# Altium project IoT_EM_ADE7758_v0.PrjPCB
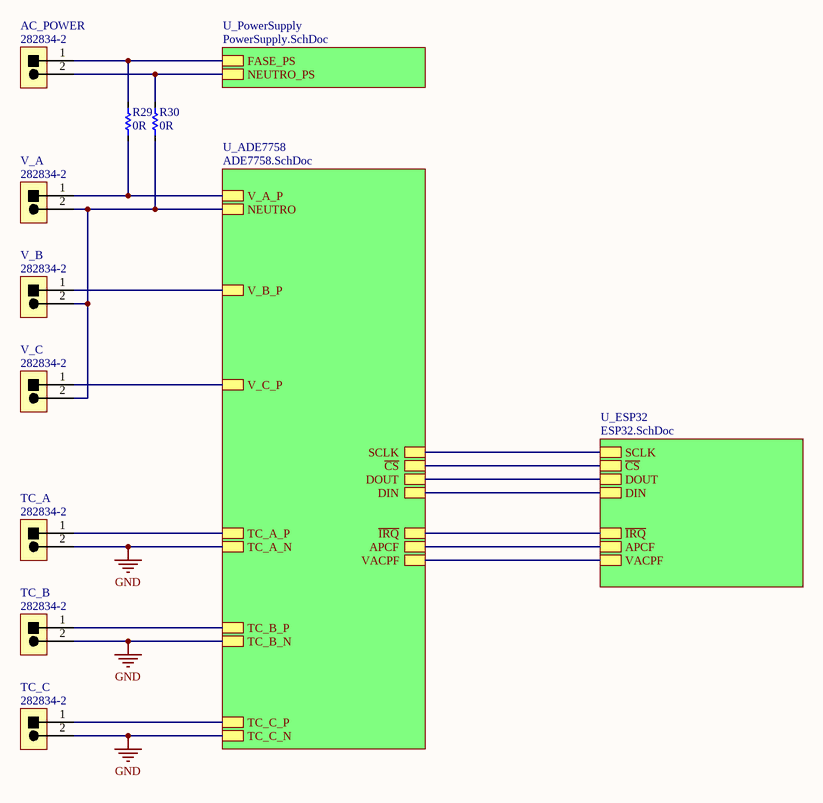
[diagram p0: Master.SchDoc]
4 sheets, 84 parts. Net scope: hierarchical (ports join the sheet entries above them; power ports are global).
Board file: IoT_EM_ADE7758_v0.PcbDoc
Sheets:
  Master.SchDoc
    U_ADE7758 = ADE7758.SchDoc
    U_PowerSupply = PowerSupply.SchDoc
    U_ESP32 = ESP32.SchDoc

## Sheet Master.SchDoc
size A4

### Parts
AC_POWER  Part Number: 282834-2  [TEC_282834-2]  (hidden comment: Conector)
R29  value 0R  [RES0603]  (hidden comment: Resistor)
R30  value 0R  [RES0603]  (hidden comment: Resistor)
TC_A  Part Number: 282834-2  [TEC_282834-2]  (hidden comment: Conector)
TC_B  Part Number: 282834-2  [TEC_282834-2]  (hidden comment: Conector)
TC_C  Part Number: 282834-2  [TEC_282834-2]  (hidden comment: Conector)
V_A  Part Number: 282834-2  [TEC_282834-2]  (hidden comment: Conector)
V_B  Part Number: 282834-2  [TEC_282834-2]  (hidden comment: Conector)
V_C  Part Number: 282834-2  [TEC_282834-2]  (hidden comment: Conector)

### Sub-sheets
U_ADE7758 = ADE7758.SchDoc: TC_A_P, TC_A_N, TC_B_P, TC_B_N, TC_C_P, TC_C_N, V_A_P, V_B_P, V_C_P, NEUTRO, SCLK, ~{CS}, DOUT, DIN, ~{IRQ}, APCF, VACPF
U_ESP32 = ESP32.SchDoc: SCLK, ~{CS}, DOUT, DIN, ~{IRQ}, APCF, VACPF
U_PowerSupply = PowerSupply.SchDoc: FASE_PS, NEUTRO_PS

### Nets
GND: TC_A.2 TC_B.2 TC_C.2 ; sheet U_ADE7758/TC_A_N, sheet U_ADE7758/TC_B_N, sheet U_ADE7758/TC_C_N
NetAC_POWER_1: AC_POWER.1 R29.1 ; sheet U_PowerSupply/FASE_PS
NetAC_POWER_2: AC_POWER.2 R30.1 ; sheet U_PowerSupply/NEUTRO_PS
NetR1_2: TC_A.1 ; sheet U_ADE7758/TC_A_P
NetR4_2: TC_B.1 ; sheet U_ADE7758/TC_B_P
NetR7_1: sheet U_ADE7758/SCLK, sheet U_ESP32/SCLK
NetR8_1: sheet U_ADE7758/~{CS}, sheet U_ESP32/~{CS}
NetR9_1: sheet U_ADE7758/DOUT, sheet U_ESP32/DOUT
NetR10_1: sheet U_ADE7758/DIN, sheet U_ESP32/DIN
NetR11_2: TC_C.1 ; sheet U_ADE7758/TC_C_P
NetR15_2: sheet U_ADE7758/~{IRQ}, sheet U_ESP32/~{IRQ}
NetR18_1: sheet U_ADE7758/APCF, sheet U_ESP32/APCF
NetR19_1: sheet U_ADE7758/VACPF, sheet U_ESP32/VACPF
NetR26_2: R30.2 V_A.2 V_B.2 V_C.2 ; sheet U_ADE7758/NEUTRO
NetR29_2: R29.2 V_A.1 ; sheet U_ADE7758/V_A_P
NetR36_2: V_B.1 ; sheet U_ADE7758/V_B_P
NetR38_2: V_C.1 ; sheet U_ADE7758/V_C_P

### Library data of the parts
AC_POWER TC_A TC_B TC_C V_A V_B V_C = Conector 2x1: TERM BLOCK 2POS SIDE ENT 2.54MM; Manufacturer: TE Connectivity AMP Connectors; Value: -; PCB Info: -

## Sheet ADE7758.SchDoc
size A4
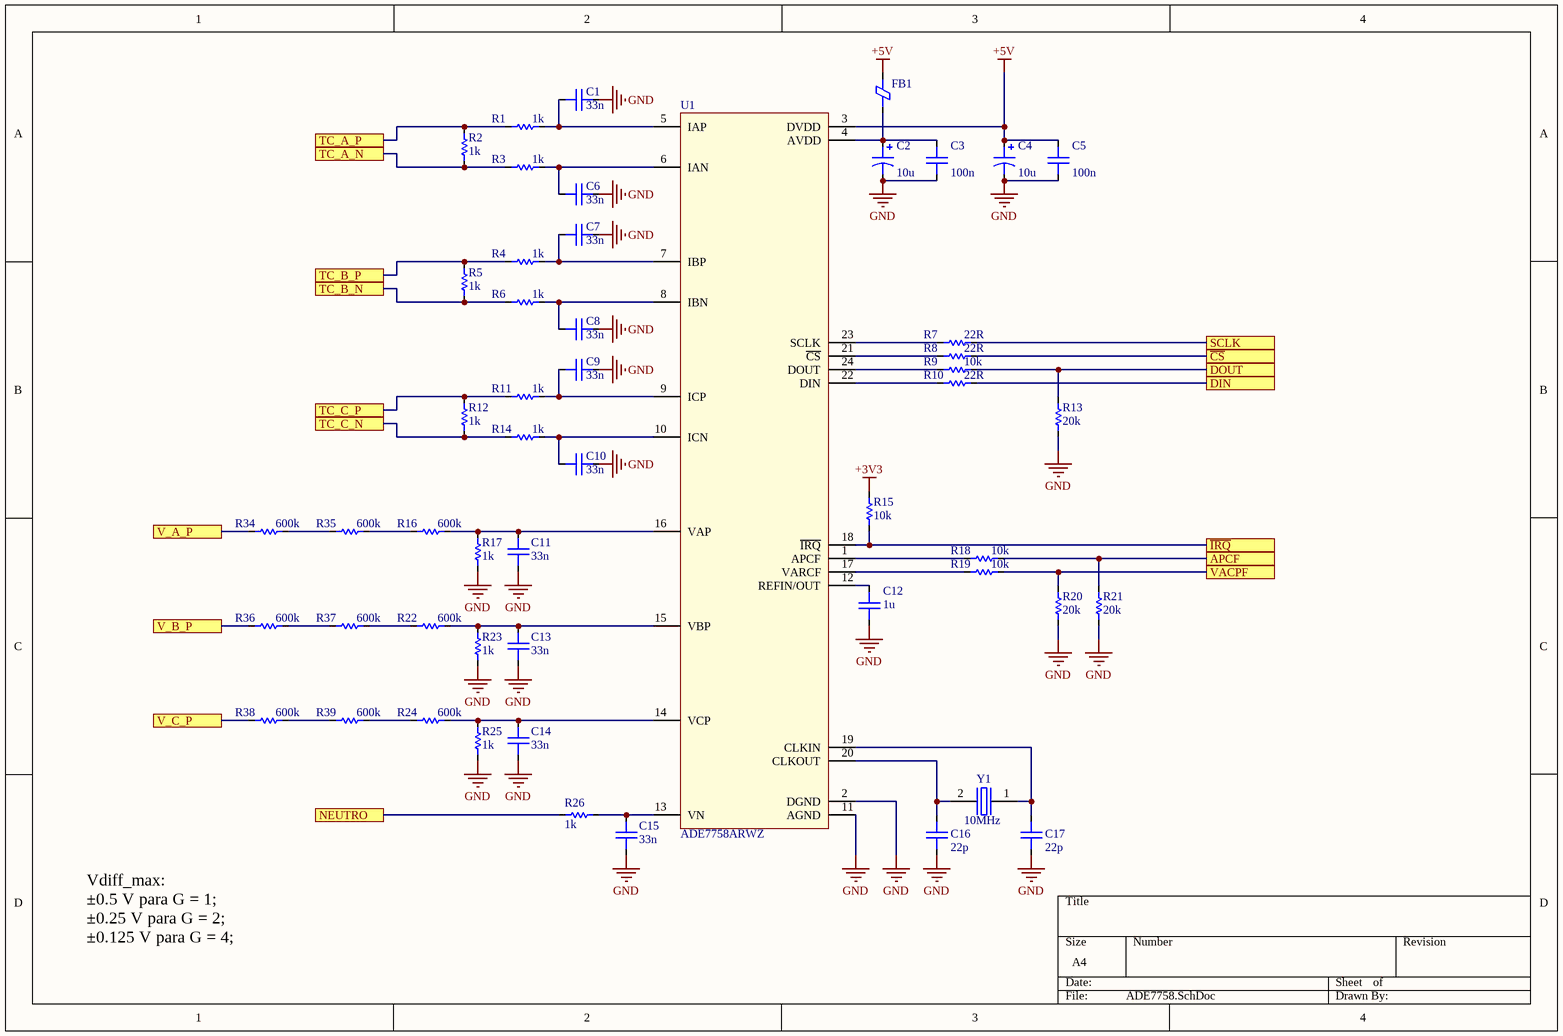
[diagram p1: ADE7758.SchDoc]

### Parts
C1  value 33n  [CAP0603]  (hidden comment: Capacitor)
C2  value 10u  [CAP1210 - TANTALUM]  (hidden comment: Capacitor)
C3  value 100n  [CAP0603]  (hidden comment: Capacitor)
C4  value 10u  [CAP1210 - TANTALUM]  (hidden comment: Capacitor)
C5  value 100n  [CAP0603]  (hidden comment: Capacitor)
C6  value 33n  [CAP0603]  (hidden comment: Capacitor)
C7  value 33n  [CAP0603]  (hidden comment: Capacitor)
C8  value 33n  [CAP0603]  (hidden comment: Capacitor)
C9  value 33n  [CAP0603]  (hidden comment: Capacitor)
C10  value 33n  [CAP0603]  (hidden comment: Capacitor)
C11  value 33n  [CAP0603]  (hidden comment: Capacitor)
C12  value 1u  [CAP0603]  (hidden comment: Capacitor)
C13  value 33n  [CAP0603]  (hidden comment: Capacitor)
C14  value 33n  [CAP0603]  (hidden comment: Capacitor)
C15  value 33n  [CAP0603]  (hidden comment: Capacitor)
C16  value 22p  [CAP0603]  (hidden comment: Capacitor)
C17  value 22p  [CAP0603]  (hidden comment: Capacitor)
FB1  Ferrite Bead  [FB0603]  (value not drawn)
R1  value 1k  [RES0603]  (hidden comment: Resistor)
R2  value 1k  [RES0603]  (hidden comment: Resistor)
R3  value 1k  [RES0603]  (hidden comment: Resistor)
R4  value 1k  [RES0603]  (hidden comment: Resistor)
R5  value 1k  [RES0603]  (hidden comment: Resistor)
R6  value 1k  [RES0603]  (hidden comment: Resistor)
R7  value 22R  [RES0603]  (hidden comment: Resistor)
R8  value 22R  [RES0603]  (hidden comment: Resistor)
R9  value 10k  [RES0603]  (hidden comment: Resistor)
R10  value 22R  [RES0603]  (hidden comment: Resistor)
R11  value 1k  [RES0603]  (hidden comment: Resistor)
R12  value 1k  [RES0603]  (hidden comment: Resistor)
R13  value 20k  [RES0603]  (hidden comment: Resistor)
R14  value 1k  [RES0603]  (hidden comment: Resistor)
R15  value 10k  [RES0603]  (hidden comment: Resistor)
R16  value 600k  [RES0603]  (hidden comment: Resistor)
R17  value 1k  [RES0603]  (hidden comment: Resistor)
R18  value 10k  [RES0603]  (hidden comment: Resistor)
R19  value 10k  [RES0603]  (hidden comment: Resistor)
R20  value 20k  [RES0603]  (hidden comment: Resistor)
R21  value 20k  [RES0603]  (hidden comment: Resistor)
R22  value 600k  [RES0603]  (hidden comment: Resistor)
R23  value 1k  [RES0603]  (hidden comment: Resistor)
R24  value 600k  [RES0603]  (hidden comment: Resistor)
R25  value 1k  [RES0603]  (hidden comment: Resistor)
R26  value 1k  [RES0603]  (hidden comment: Resistor)
R34  value 600k  [RES0603]  (hidden comment: Resistor)
R35  value 600k  [RES0603]  (hidden comment: Resistor)
R36  value 600k  [RES0603]  (hidden comment: Resistor)
R37  value 600k  [RES0603]  (hidden comment: Resistor)
R38  value 600k  [RES0603]  (hidden comment: Resistor)
R39  value 600k  [RES0603]  (hidden comment: Resistor)
U1  ADE7758ARWZ  [SOIC-24]
Y1  value 10MHz  [HDR1X2]  (hidden comment: Cristal)

### Ports
APCF, DIN, DOUT, NEUTRO, SCLK, TC_A_N, TC_A_P, TC_B_N, TC_B_P, TC_C_N, TC_C_P, V_A_P, V_B_P, V_C_P, VACPF, ~{CS}, ~{IRQ}

### Nets
+3V3: R15.1
+5V: C4.1 C5.2 FB1.1 U1.3(DVDD)
GND: C1.1 C2.2 C3.1 C4.2 C5.1 C6.1 C7.1 C8.1 C9.1 C10.1 C11.2 C12.1 C13.2 C14.2 C15.2 C16.1 C17.1 R2.2 R3.2 R5.2 R6.2 R12.2 R13.2 R14.2 R17.1 R20.2 R21.2 R23.1 R25.1 U1.2(DGND) U1.11(AGND) ; port TC_A_N, port TC_B_N, port TC_C_N
NetC1_2: C1.2 R1.1 U1.5(IAP)
NetC2_1: C2.1 C3.2 FB1.2 U1.4(AVDD)
NetC6_2: C6.2 R3.1 U1.6(IAN)
NetC7_2: C7.2 R4.1 U1.7(IBP)
NetC8_2: C8.2 R6.1 U1.8(IBN)
NetC9_2: C9.2 R11.1 U1.9(ICP)
NetC10_2: C10.2 R14.1 U1.10(ICN)
NetC11_1: C11.1 R16.1 R17.2 U1.16(VAP)
NetC12_2: C12.2 U1.12(REFIN/OUT)
NetC13_1: C13.1 R22.1 R23.2 U1.15(VBP)
NetC14_1: C14.1 R24.1 R25.2 U1.14(VCP)
NetC15_1: C15.1 R26.1 U1.13(VN)
NetC16_2: C16.2 U1.20(CLKOUT) Y1.2
NetC17_2: C17.2 U1.19(CLKIN) Y1.1
NetR1_2: R1.2 R2.1 ; port TC_A_P
NetR4_2: R4.2 R5.1 ; port TC_B_P
NetR7_1: R7.1 ; port SCLK
NetR7_2: R7.2 U1.23(SCLK)
NetR8_1: R8.1 ; port ~{CS}
NetR8_2: R8.2 U1.21(~{CS})
NetR9_1: R9.1 R13.1 ; port DOUT
NetR9_2: R9.2 U1.24(DOUT)
NetR10_1: R10.1 ; port DIN
NetR10_2: R10.2 U1.22(DIN)
NetR11_2: R11.2 R12.1 ; port TC_C_P
NetR15_2: R15.2 U1.18(~{IRQ}) ; port ~{IRQ}
NetR16_2: R16.2 R35.1
NetR18_1: R18.1 R21.1 ; port APCF
NetR18_2: R18.2 U1.1(APCF)
NetR19_1: R19.1 R20.1 ; port VACPF
NetR19_2: R19.2 U1.17(VARCF)
NetR22_2: R22.2 R37.1
NetR24_2: R24.2 R39.1
NetR26_2: R26.2 ; port NEUTRO
NetR29_2: R34.2 ; port V_A_P
NetR34_1: R34.1 R35.2
NetR36_1: R36.1 R37.2
NetR36_2: R36.2 ; port V_B_P
NetR38_1: R38.1 R39.2
NetR38_2: R38.2 ; port V_C_P

### Notes on the sheet
- Vdiff_max:
  ±0.5 V para G = 1;
  ±0.25 V para G = 2;
  ±0.125 V para G = 4;

### Library data of the parts
C2 C4 = Capacitor Polarizado
U1 = ADE7758ARWZ: IC ENERGY METERING 3PHASE 24SOIC; Manufacturer: Analog Devices Inc.; PCB Info: -; Value: -; Part Number: ADE7758ARWZ
Y1 = Cristal: Manufacturer: ECS Inc.; PCB Info: -

## Sheet PowerSupply.SchDoc
size A4
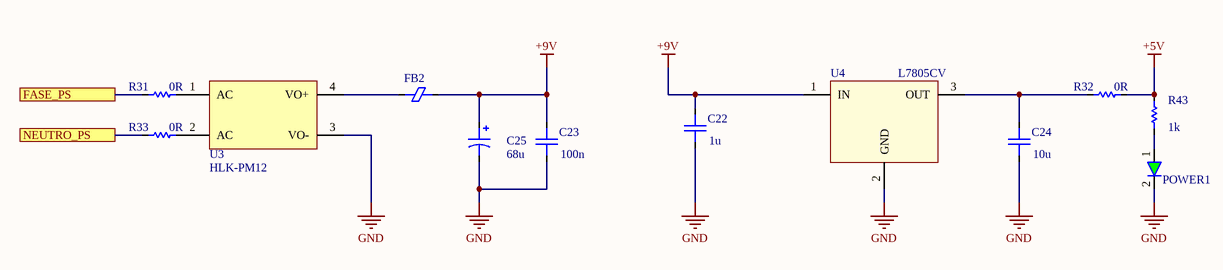
[diagram p2: PowerSupply.SchDoc]

### Parts
C22  value 1u  [CAP0603]  (hidden comment: Capacitor)
C23  value 100n  [CAP0603]  (hidden comment: Capacitor)
C24  value 10u  [CAP0603]  (hidden comment: Capacitor)
C25  value 68u  [CAP_ALU_6.3x7.7]  (hidden comment: Capacitor)
FB2  Ferrite Bead  [FB0603]  (value not drawn)
POWER1  LED Green  [HDR1X2]  (value not drawn)
R31  value 0R  [RES0603]  (hidden comment: Resistor)
R32  value 0R  [RES0603]  (hidden comment: Resistor)
R33  value 0R  [RES0603]  (hidden comment: Resistor)
R43  value 1k  [RES0603]  (hidden comment: Resistor)
U3  HLK-PM12  [HLP-PM12]
U4  L7805CV  [TO-220 - 90°]

### Ports
FASE_PS, NEUTRO_PS

### Nets
+5V: R32.1 R43.1
+9V: C22.2 C23.2 C25.1 FB2.1 U4.1(IN)
GND: C22.1 C23.1 C24.1 C25.2 POWER1.2(K) U3.3(VO-) U4.2(GND)
NetAC_POWER_1: R31.2 ; port FASE_PS
NetAC_POWER_2: R33.2 ; port NEUTRO_PS
NetC24_2: C24.2 R32.2 U4.3(OUT)
NetFB2_2: FB2.2 U3.4(VO+)
NetPOWER1_1: POWER1.1(A) R43.2
NetR31_1: R31.1 U3.1(AC)
NetR33_1: R33.1 U3.2(AC)

### Library data of the parts
C22-C24 = Capacitor: CAP CER SMD 0603; Manufacturer: -; Part Number: -; PCB Info: -
C25 = Capacitor Polarizado
U3 = HLK-PM12: Flyback power supply AC to 12V@3W; Manufacturer: HI-LINK; Value: 90-264 VAC to 12VDC@3W; Part Number: HLK-PM12; PCB Info: -
U4 = L7805CV: IC REG LINEAR 5V 1.5A TO220; Manufacturer: STMicroelectronics; Value: -; Part Number: L7805CV
POWER1 = LED Green: Manufacturer: -; PCB Info: -; Value: -; Part Number: -

## Sheet ESP32.SchDoc
size A4
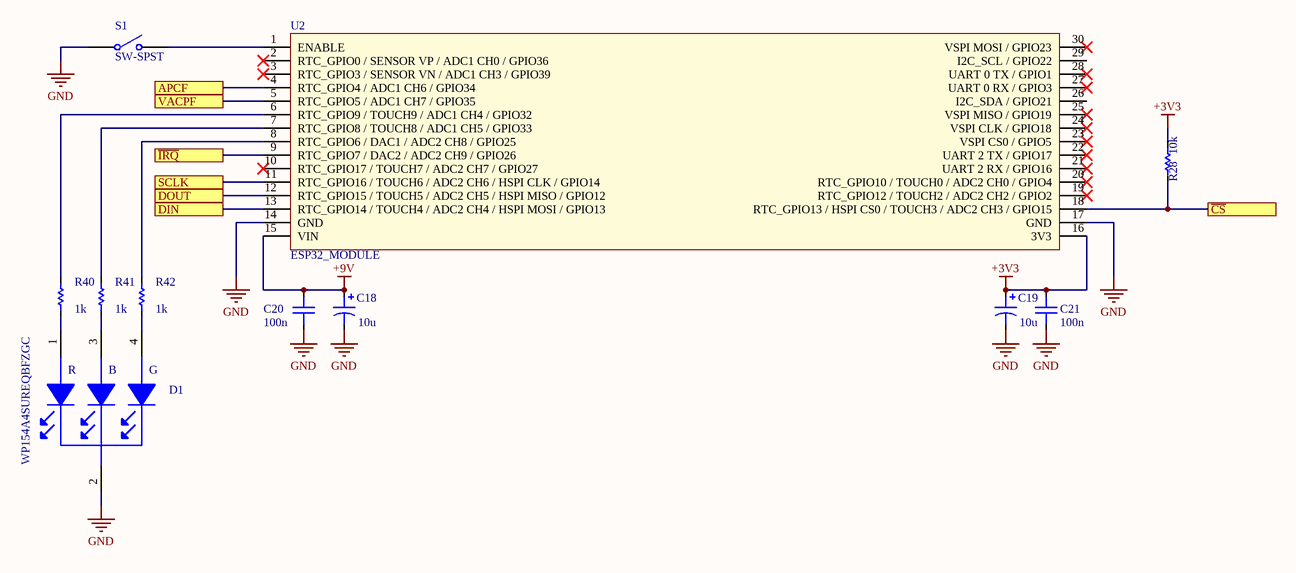
[diagram p3: ESP32.SchDoc]

### Parts
C18  value 10u  [CAP1210 - TANTALUM]  (hidden comment: Capacitor)
C19  value 10u  [CAP1210 - TANTALUM]  (hidden comment: Capacitor)
C20  value 100n  [CAP0603]  (hidden comment: Capacitor)
C21  value 100n  [CAP0603]  (hidden comment: Capacitor)
D1  WP154A4SUREQBFZGC  [HDR1X4]
R28  value 10k  [RES0603]  (hidden comment: Resistor)
R40  value 1k  [RES0603]  (hidden comment: Resistor)
R41  value 1k  [RES0603]  (hidden comment: Resistor)
R42  value 1k  [RES0603]  (hidden comment: Resistor)
S1  SW-SPST  [HDR1X2]
U2  ESP32_MODULE  [ESP32 DEVKIT V1 DOIT]

### Ports
APCF, DIN, DOUT, SCLK, VACPF, ~{CS}, ~{IRQ}

### Nets
+3V3: C19.1 C21.2 R28.1 U2.16(3V3)
+9V: C18.1 C20.2 U2.15(VIN)
GND: C18.2 C19.2 C20.1 C21.1 D1.2(K) S1.1(COMMON) U2.14(GND) U2.17(GND)
NetD1_1: D1.1(A1) R40.2
NetD1_3: D1.3(A2) R41.2
NetD1_4: D1.4(A3) R42.2
NetR7_1: U2.11(RTC_GPIO16_/_TOUCH6_/_ADC2_CH6_/_HSPI_CLK_/_GPIO14) ; port SCLK
NetR8_1: R28.2 U2.18(RTC_GPIO13_/_HSPI_CS0_/_TOUCH3_/_ADC2_CH3_/_GPIO15) ; port ~{CS}
NetR9_1: U2.12(RTC_GPIO15_/_TOUCH5_/_ADC2_CH5_/_HSPI_MISO_/_GPIO12) ; port DOUT
NetR10_1: U2.13(RTC_GPIO14_/_TOUCH4_/_ADC2_CH4_/_HSPI_MOSI_/_GPIO13) ; port DIN
NetR15_2: U2.9(RTC_GPIO7_/_DAC2_/_ADC2_CH9_/_GPIO26) ; port ~{IRQ}
NetR18_1: U2.4(RTC_GPIO4_/_ADC1_CH6_/_GPIO34) ; port APCF
NetR19_1: U2.5(RTC_GPIO5_/_ADC1_CH7_/_GPIO35) ; port VACPF
NetR40_1: R40.1 U2.6(RTC_GPIO9_/_TOUCH9_/_ADC1_CH4_/_GPIO32)
NetR41_1: R41.1 U2.7(RTC_GPIO8_/_TOUCH8_/_ADC1_CH5_/_GPIO33)
NetR42_1: R42.1 U2.8(RTC_GPIO6_/_DAC1_/_ADC2_CH8_/_GPIO25)
NetS1_2: S1.2(NO) U2.1(ENABLE)

Not connected (* = marked no-connect by the designer): U2 2(RTC_GPIO0_/_SENSOR_VP_/_ADC1_CH0_/_GPIO36)* 3(RTC_GPIO3_/_SENSOR_VN_/_ADC1_CH3_/_GPIO39)* 10(RTC_GPIO17_/_TOUCH7_/_ADC2_CH7_/_GPIO27)* 19(RTC_GPIO12_/_TOUCH2_/_ADC2_CH2_/_GPIO2)* 20(RTC_GPIO10_/_TOUCH0_/_ADC2_CH0_/_GPIO4)* 21(UART_2_RX_/_GPIO16)* 22(UART_2_TX_/_GPIO17)* 23(VSPI_CS0_/_GPIO5)* 24(VSPI_CLK_/_GPIO18)* 25(VSPI_MISO_/_GPIO19)* 26(I2C_SDA_/_GPIO21) 27(UART_0_RX_/_GPIO3)* 28(UART_0_TX_/_GPIO1)* 29(I2C_SCL_/_GPIO22) 30(VSPI_MOSI_/_GPIO23)*

### Notes on the sheet
- (in symbol LED RGB K) R; B; G

### Library data of the parts
C18 C19 = Capacitor Polarizado
D1 = LED RGB K: Manufacturer: Kingbright; Component Footprint: LED_RGB_5mm; CompType: LED; Tem na PHB: Não; Part Number: WP154A4SUREQBFZGC; Value: WP154A4SUREQBFZGC
S1 = SW-SPST: Single-Pole, Single-Throw Switch; Published: 24-Mar-1999; LatestRevisionDate: 17-Jul-2002; LatestRevisionNote: Re-released for DXP Platform.; PackageReference: SPST-2; Publisher: Altium Limited; PackageDescription: Switch; 2 Leads
U2 = ESP32_MODULE: Manufacturer: -; PCB Info: -; Value: -; Part Number: ESP32_MODULE

## Nets that join several sheets
+3V3: ADE7758 (R15.1), ESP32 (C19.1 C21.2 R28.1 U2.16)
+5V: ADE7758 (C4.1 C5.2 FB1.1 U1.3), PowerSupply (R32.1 R43.1)
+9V: PowerSupply (5 pins), ESP32 (C18.1 C20.2 U2.15)
GND: Master (TC_A.2 TC_B.2 TC_C.2), ADE7758 (31 pins), PowerSupply (7 pins), ESP32 (8 pins)
NetAC_POWER_1: Master (AC_POWER.1 R29.1), PowerSupply (R31.2)
NetAC_POWER_2: Master (AC_POWER.2 R30.1), PowerSupply (R33.2)
NetR1_2: Master (TC_A.1), ADE7758 (R1.2 R2.1)
NetR4_2: Master (TC_B.1), ADE7758 (R4.2 R5.1)
NetR7_1: ADE7758 (R7.1), ESP32 (U2.11)
NetR8_1: ADE7758 (R8.1), ESP32 (R28.2 U2.18)
NetR9_1: ADE7758 (R9.1 R13.1), ESP32 (U2.12)
NetR10_1: ADE7758 (R10.1), ESP32 (U2.13)
NetR11_2: Master (TC_C.1), ADE7758 (R11.2 R12.1)
NetR15_2: ADE7758 (R15.2 U1.18), ESP32 (U2.9)
NetR18_1: ADE7758 (R18.1 R21.1), ESP32 (U2.4)
NetR19_1: ADE7758 (R19.1 R20.1), ESP32 (U2.5)
NetR26_2: Master (R30.2 V_A.2 V_B.2 V_C.2), ADE7758 (R26.2)
NetR29_2: Master (R29.2 V_A.1), ADE7758 (R34.2)
NetR36_2: Master (V_B.1), ADE7758 (R36.2)
NetR38_2: Master (V_C.1), ADE7758 (R38.2)